# EAGLE design LDBiasDriver CC v2 (EAGLE 7.7.0)
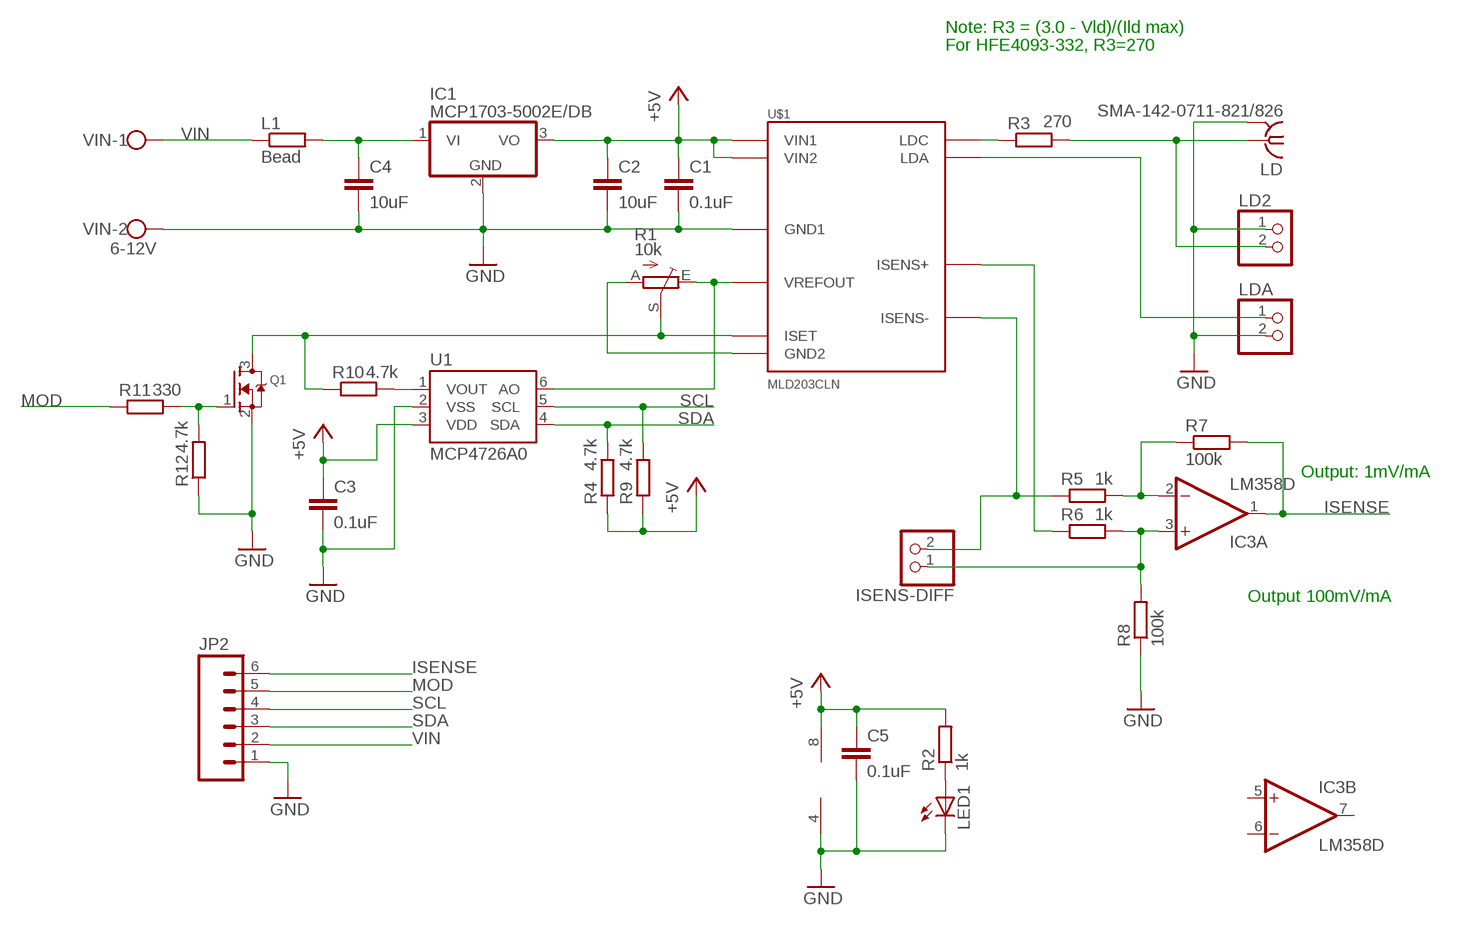
[diagram p0: schematic, sheet 1]

## Parts
C1  0.1uF  C-EUC0805  [C0805]
C2  10uF  C-EUC0805  [C0805]
C3  0.1uF  C-EUC0805  [C0805]
C4  10uF  C-EUC0805  [C0805]
C5  0.1uF  C-EUC0805  [C0805]
IC1  MCP1703-5002E/DB  MCP1703DB  [SOT223]
IC3  LM358D  [SO08]
ISENS-DIFF  PINHD-1X2  [1X02]
JP2  M06POLAR_LOCK  [MOLEX-1X6_LOCK]
L1  Bead  R-EU_R0805  [R0805]
LD  SMA-142-0711-821/826  [J502-ND-142-0711-821/826]
LD2  PINHD-1X2  [1X02]
LDA  PINHD-1X2  [1X02]
LED1  LEDCHIPLED_1206  [CHIPLED_1206]
Q1  MOSFET-NREFLOW  [SOT23]
R1  10k  TRIM_EU-RJ9W  [RJ9W]
R2  1k  R-EU_R0805  [R0805]
R3  270  R-EU_R0805  [R0805]
R4  4.7k  R-EU_R0805  [R0805]
R5  1k  R-EU_R0805  [R0805]
R6  1k  R-EU_R0805  [R0805]
R7  100k  R-EU_R0805  [R0805]
R8  100k  R-EU_R0805  [R0805]
R9  4.7k  R-EU_R0805  [R0805]
R10  4.7k  R-EU_R0805  [R0805]
R11  330  R-EU_R0805  [R0805]
R12  4.7k  R-EU_R0805  [R0805]
U1  MCP4726A0  MCP4725SOT-23  [SOT23-6]
U$1  MLD203CLN  [MLD203]
VIN  6-12V  W237-102  [W237-102]

## Nets
+5V: C1.1 C2.1 C3.1 C5.1 IC1.3(VO) IC3.8(P:V+) R2.2 R4.1 R9.1 U1.3(VDD) U$1.P$1(VIN1) U$1.P$2(VIN2)
GND: C1.2 C2.2 C3.2 C4.2 C5.2 IC1.2(GND) IC3.4(P:V-) JP2.1 LD2.1 LD.G@1 LD.G@2 LD.G@3 LD.G@4 LDA.2 LED1.C Q1.2(S) R8.1 R12.1 U1.2(VSS) U$1.P$3(GND1) VIN.2
ISENSE: IC3.1(A:OUT) JP2.6 R7.2
MOD: JP2.5 R11.1
N$2: R1.E U1.6(AO) U$1.P$5(VREFOUT)
N$3: LED1.A R2.1
N$4: Q1.3(D) R1.S R10.1 U$1.P$6(ISET)
N$5: R1.A U$1.P$4(GND2)
N$6: R6.1 U$1.P$12(ISENS+)
N$7: ISENS-DIFF.2 R5.1 U$1.P$13(ISENS-)
N$8: LD2.2 LD.1 R3.2
N$9: R3.1 U$1.P$11(LDC)
N$10: Q1.1(G) R11.2 R12.2
N$11: LDA.1 U$1.P$14(LDA)
N$13: R10.2 U1.1(VOUT)
N$15: C4.1 IC1.1(VI) L1.2
N$16: IC3.2(A:-IN) R5.2 R7.1
N$17: IC3.3(A:+IN) ISENS-DIFF.1 R6.2 R8.2
SCL: JP2.4 R9.2 U1.5(SCL)
SDA: JP2.3 R4.2 U1.4(SDA)
VIN: JP2.2 L1.1 VIN.1
Unconnected: IC3.5(B:+IN) IC3.6(B:-IN) IC3.7(B:OUT)

## Notes on the sheet
- Note: R3 = (3.0 - Vld)/(Ild max)
- For HFE4093-332, R3=270
- Output: 1mV/mA
- Output 100mV/mA

## Library data of the parts
C1-C5 = rcl:C-EU: CAPACITOR, European symbol
IC1 = linear:MCP1703: 250 mA, 16V, Low Quiescent Current LDO Regulator Source: http://ww1.microchip.com/downloads/en/DeviceDoc/22049b.pdf
IC3 = linear:LM358: OP AMP also LM158; LM258; LM2904 Source: http://cache.national.com/ds/LM/LM158.pdf
ISENS-DIFF LD2 LDA = pinhead:PINHD-1X2: PIN HEADER
JP2 = SparkFun-Connectors:M06: Header 6 Standard 6-pin 0.1" header. Use with straight break away headers (SKU : PRT-00116), right angle break away headers (PRT-00553), swiss pins (PRT-00743), machine pins (PRT-00117), and female headers (PRT-00115). Molex polarized connector foot print use with SKU : PRT-08094 with associated crimp pins and housings. NOTES ON THE VARIANTS LOCK and LOCK_LONGPADS... This footprint was designed to help hold the alignment of a through-hole component (i.e. 6-pin header) while soldering it into place. You may notice that each hole has been shifted either up or down by 0.005 of an inch from it's more standard position (which is a perfectly straight line). This slight alteration caused the pins (the squares in the middle) to touch the edges of the holes. Because they are alternating, it causes a "brace" to hold the component in place. 0.005 has proven to be the perfect amount of "off-center" position when using our standard breakaway headers. Although looks a little odd when you look at the bare footprint, once you have a header in there, the alteration is very hard to notice. Also,if you push a header all the way into place, it is covered up entirely on the bottom side. This idea of altering the position of holes to aid alignment will be further integrated into the Sparkfun Library for other footprints. It can help hold any component with 3 or more connection pins.
L1 R2-R12 = rcl:R-EU_: RESISTOR, European symbol
LD = con-coax:SMA-: SMA 50 Ohm End Launch Jack Receptacle - Round Contact Johnson Components Source: www.johnsoncomponents.com .. J502-ND.pdf; MF: JOHNSON COMPONENTS; MPN: 142-0711-821; OC_FARNELL: 1019328; OC_NEWARK: 16F3627
LED1 = led:LED: LED OSRAM: - CHIPLED LG R971, LG N971, LY N971, LG Q971, LY Q971, LO R971, LY R971 LH N974, LH R974 LS Q976, LO Q976, LY Q976 LO Q996 - Hyper CHIPLED LW Q18S LB Q993, LB Q99A, LB R99A - SideLED LS A670, LO A670, LY A670, LG A670, LP A670 LB A673, LV A673, LT A673, LW A673 LH A674 LY A675 LS A676, LA A676, LO A676, LY A676, LW A676 LS A679, LY A679, LG A679 - Hyper Micro SIDELED® LS Y876, LA Y876, LO Y876, LY Y876 LT Y87S - SmartLED LW L88C, LW L88S LB L89C, LB L89S, LG L890 LS L89K, LO L89K, LY L89K LS L896, LA L896, LO L896, LY L896 - TOPLED LS T670, LO T670, LY T670, LG T670, LP T670 LSG T670, LSP T670, LSY T670, LOP T670, LYG T670 LG T671, LOG T671, LSG T671 LB T673, LV T673, LT T673, LW T673 LH T674 LS T676, LA T676, LO T676, LY T676, LB T676, LH T676, LSB T676, LW T676 LB T67C, LV T67C, LT T67C, LS T67K, LO T67K, LY T67K, LW E67C LS E67B, LA E67B, LO E67B, LY E67B, LB E67C, LV E67C, LT E67C LW T67C LS T679, LY T679, LG T679 LS T770, LO T770, LY T770, LG T770, LP T770 LB T773, LV T773, LT T773, LW T773 LH T774 LS E675, LA E675, LY E675, LS T675 LS T776, LA T776, LO T776, LY T776, LB T776 LHGB T686 LT T68C, LB T68C - Hyper Mini TOPLED® LB M676 - Mini TOPLED Santana® LG M470 LS M47K, LO M47K, LY M47K Source: http://www.osram.convergy.de LUXEON: - LUMILED® LXK2-PW12-R00, LXK2-PW12-S00, LXK2-PW14-U00, LXK2-PW14-V00 LXK2-PM12-R00, LXK2-PM12-S00, LXK2-PM14-U00 LXK2-PE12-Q00, LXK2-PE12-R00, LXK2-PE12-S00, LXK2-PE14-T00, LXK2-PE14-U00 LXK2-PB12-K00, LXK2-PB12-L00, LXK2-PB12-M00, LXK2-PB14-N00, LXK2-PB14-P00, LXK2-PB14-Q00 LXK2-PR12-L00, LXK2-PR12-M00, LXK2-PR14-Q00, LXK2-PR14-R00 LXK2-PD12-Q00, LXK2-PD12-R00, LXK2-PD12-S00 LXK2-PH12-R00, LXK2-PH12-S00 LXK2-PL12-P00, LXK2-PL12-Q00, LXK2-PL12-R00 Source: www.luxeon.com KINGBRIGHT: KA-3528ASYC Source: www.kingbright.com
Q1 = adafruit:MOSFET-N: N-Channel Mosfet 2N7002E - 60V 260mA SOT23 [Digikey: 2N7002ET1GOSTR-ND] - REEL BSH103 - 30V 850mA SOT23 [Digikey: 568-5013-1-ND]
R1 = pot:TRIM_EU-: POTENTIOMETER
U1 = SparkFun-AnalogIC:MCP4725: Microchip 12-bit I2C DAC, SOT23-6; PROD_ID: IC-08886; VALUE: MCP4725
U$1 = laser diode:MLD203CLN
VIN = con-wago-500:W237-102: WAGO SCREW CLAMP; MPN: 237-102; OC_FARNELL: unknown; OC_NEWARK: 70K9898

## Board
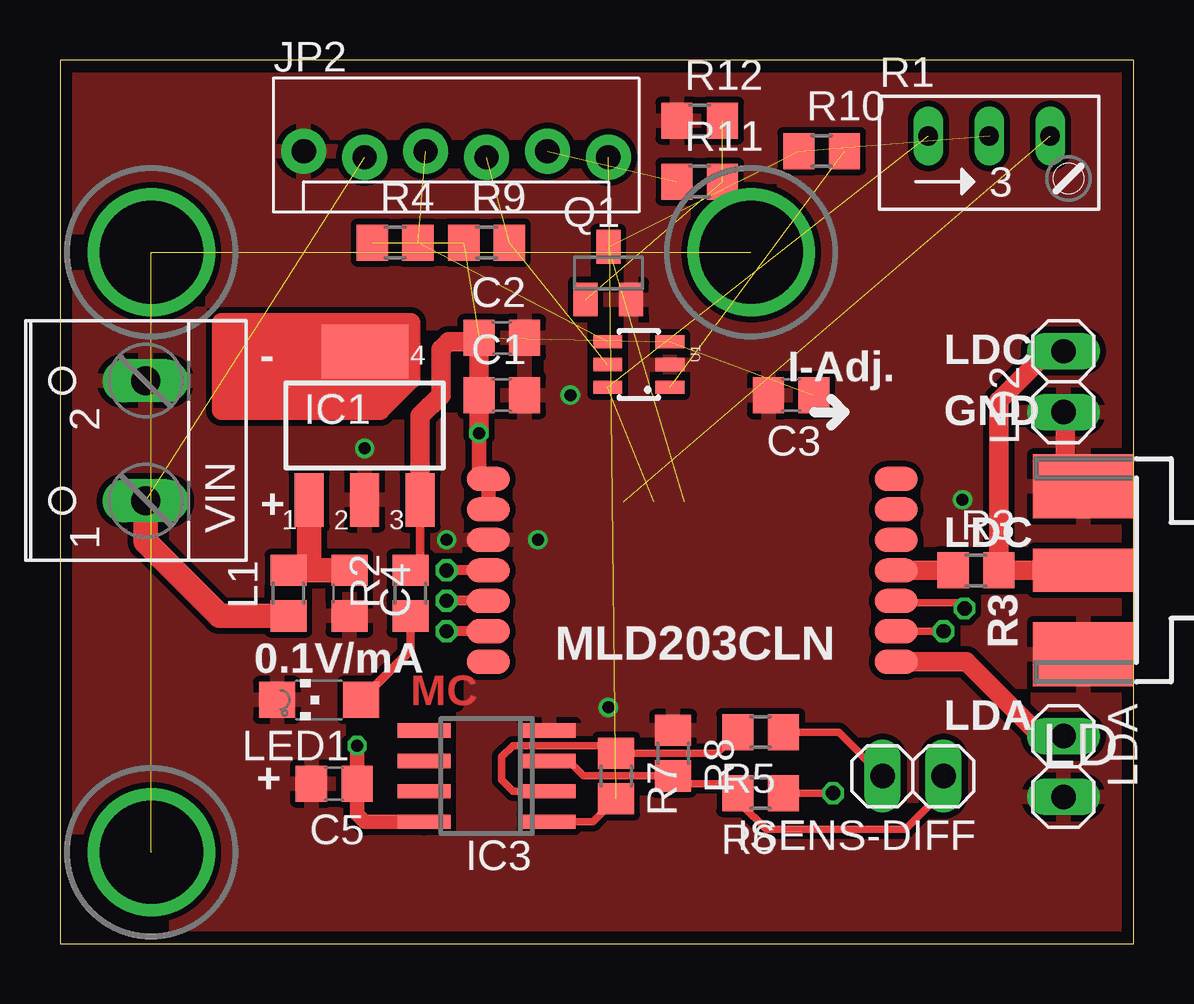
[diagram p1: board, top side]
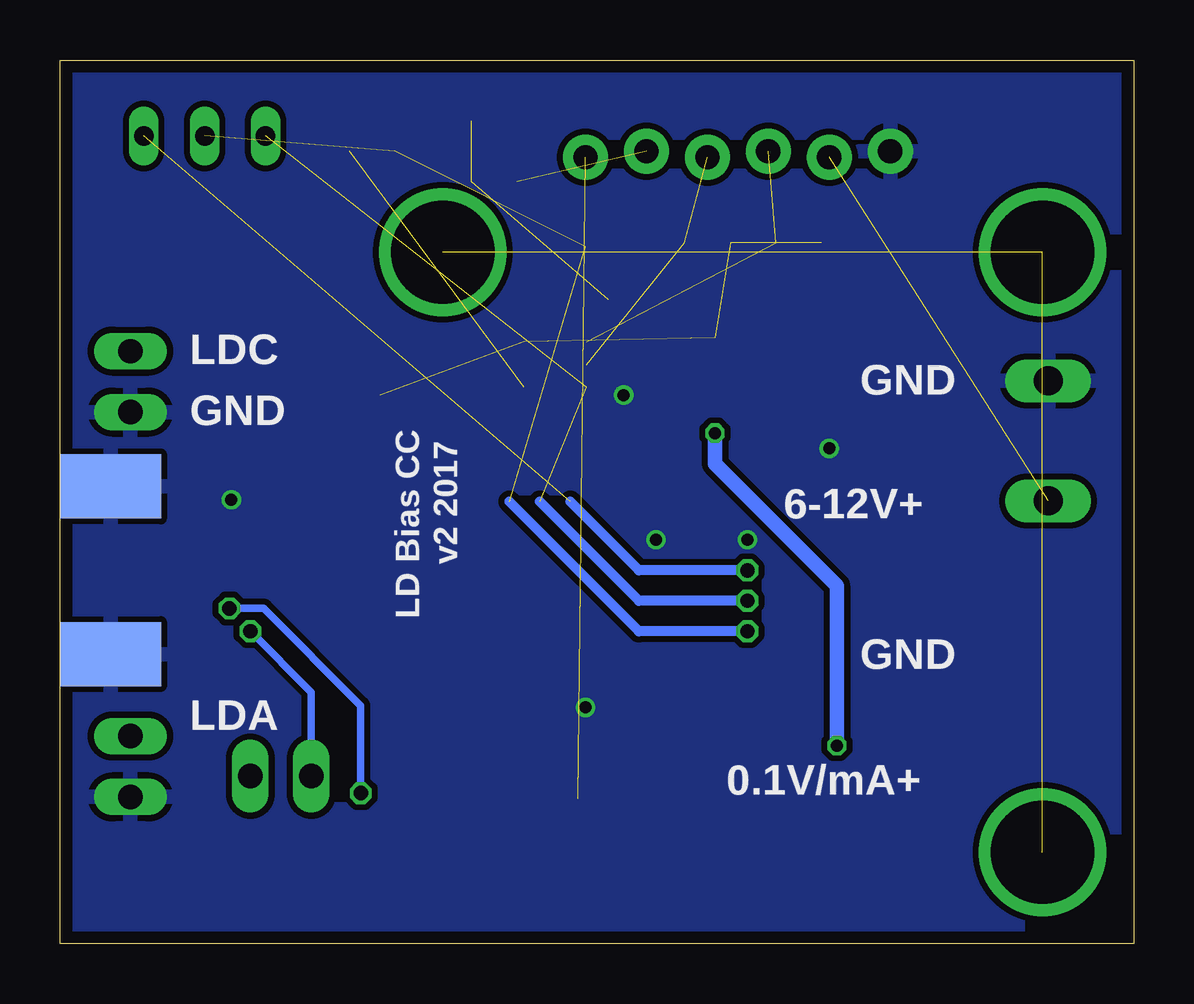
[diagram p2: board, bottom side, seen from below]

Size 44.77 x 36.82 mm. Coordinates in mm from the lower left corner, seen from the top.
Outline: 0,36.82 0,0 44.76,0 44.76,36.82 0,36.82
Copper layers (1*16): Top 0.035mm / dielectric 1.6mm / Bottom 0.035mm
Design rules "Elecrow_2-layer_PCB_eagle_rule *": minimum track width 6mil, minimum drill 12mil, track to track 10mil, track to pad 10mil, pad to pad 10mil, via to via 10mil, smd to smd 10mil, copper to edge 20mil, drill to drill 10mil, minimum pad ring 6mil, minimum via ring 6mil, stop-mask expansion 0mil, vias tented up to drill 100mil, thermal gap 10mil

### Footprints (pad centres in the part's own frame; a part is rotated, then mirrored left to right if it is on the bottom)
C0805 = smd 1.3 x 1.5: 1 -0.95,0; 2 0.95,0
SOT223 = smd 1.219 x 2.235: 1 -2.311,-3.099; 2 0,-3.099; 3 2.311,-3.099 | smd 3.6 x 2.2: 4 0,3.099
SO08 = smd 0.6 x 2.2: 1 -1.905,-2.6; 2 -0.635,-2.6; 3 0.635,-2.6; 4 1.905,-2.6; 5 1.905,2.6; 6 0.635,2.6; 7 -0.635,2.6; 8 -1.905,2.6
1X02 = drill 1.016 long: 1 -1.27,0; 2 1.27,0
MOLEX-1X6_LOCK = drill 1.016 pad 1.88: 1 0,0; 2 2.54,-0.254; 3 5.08,0; 4 7.62,-0.254; 5 10.16,0; 6 12.7,-0.254
R0805 = smd 1.3 x 1.5: 1 -0.95,0; 2 0.95,0
J502-ND-142-0711-821/826 = smd 4.191 x 1.778: 1 2.115,0 | smd 4.191 x 2.667: G@1 2.115,3.495; G@2 2.115,-3.495 | smd 4.191 x 2.667 bottom: G@3 2.115,3.495; G@4 2.115,-3.495
CHIPLED_1206 = smd 1.5 x 1.5: A 0,-1.75; C 0,1.75
SOT23 = smd 1 x 1.4: 1 -0.95,-1.1; 2 0.95,-1.1; 3 0,1.1
RJ9W = drill 0.813 long: A 2.54,0.635; E -2.54,0.635; S 0,0.635
SOT23-6 = smd 0.55 x 1.2: 1 0.95,1.3; 2 0,1.3; 3 -0.95,1.3; 4 -0.95,-1.3; 5 0,-1.3; 6 0.95,-1.3
MLD203 = smd 1.8 x 1: P$1 0,0; P$2 0,-1.27; P$3 0,-2.54; P$4 0,-3.81; P$5 0,-5.08; P$6 0,-6.35; P$7 0,-7.62; P$8 17,0; P$9 17,-1.27; P$10 17,-2.54; P$11 17,-3.81; P$12 17,-5.08; P$13 17,-6.35; P$14 17,-7.62
W237-102 = drill 1.194 long: 1 -2.5,-1.27; 2 2.5,-1.27

### Placement (x,y rotation side)
C1  18.41,22.86 0 top
C2  18.41,25.24 0 top
C3  30.48,22.86 180 top
C4  12.06,14.61 270 top
C5  11.43,6.67 180 top
IC1  12.7,21.59 0 top
IC3  17.78,6.99 90 top
ISENS-DIFF  35.56,6.99 180 top
JP2  10.16,33.02 0 top
L1  9.53,14.61 90 top
LD  44.77,15.56 180 top
LD2  41.83,23.42 90 top
LDA  41.83,7.38 270 top
LED1  10.79,10.16 90 top
Q1  22.86,27.94 0 top
R1  38.73,33.02 0 top
R2  14.61,14.61 90 top
R3  38.18,15.56 0 top
R4  13.97,29.21 0 top
R5  29.21,8.81 180 top
R6  29.21,6.27 180 top
R7  23.18,6.99 270 top
R8  25.56,7.94 270 top
R9  17.78,29.21 0 top
R10  31.75,33.02 0 top
R11  26.67,31.75 0 top
R12  26.67,34.29 0 top
U1  24.13,24.13 270 top
U$1  17.86,19.37 0 top
VIN  2.3,20.95 90 top

### Tracks (layer width: path | path; a pad name or v marks a point on that pad's centre or on a via)
+5V  (via drill 0.5)  (4 unrouted)
  Top 0.356: IC1.3 15.01,15.96
  Top 0.61: 15.01,15.96 R2.2 | IC3.8 12.7,5.08 12.38,5.4 C5.1 12.7,6.99 12.38,7.3 v12.38,8.26 | U$1.P$2 U$1.P$1 17.46,19.76 v17.46,21.27
  Top 0.813: IC1.3 15.01,22 15.88,22.86 15.88,24.77 16.19,25.08 17.31,25.08 C2.1 C1.1 v17.46,21.27
  Bottom 0.61: v17.46,21.27 17.46,20 12.38,14.92 v12.38,8.26
GND  (via drill 0.5)
  Top 0.813: LD2.1 41.91,22.15 41.91,19.05 LD.G@2
  other vias: 21.27,22.86 22.86,9.84 12.7,20.64 16.11,16.83 19.92,16.83 37.62,18.49
  pour Top: 0,36.83 44.69,36.83 47.23,-1.27 -1.27,-1.27
  pour Bottom: 0,36.83 44.85,36.83 48.66,-1.35 -2.54,-2.62
ISENSE  (1 unrouted)
  Top 0.305: R7.2 22.22,5.08 IC3.1
MOD  (1 unrouted)
N$1
  Top 0.813: 13.97,25.4 6.75,25.4 | 6.75,25.4 6.75,22.23 13.34,22.23 14.61,23.5 14.61,25.88 6.75,25.88 6.75,25.4
N$2  (via drill 0.6)  (2 unrouted)
  Top 0.406: U$1.P$5 v16.11,14.29
  Bottom 0.406: v16.11,14.29 20.64,14.29 24.77,18.41
N$3
  Top 0.356: R2.1 14.61,12.22 LED1.A
N$4  (via drill 0.6)  (3 unrouted)
  Top 0.406: U$1.P$6 v16.11,13.02
  Bottom 0.406: v16.11,13.02 20.64,13.02 26.04,18.41
N$5  (via drill 0.6)  (1 unrouted)
  Top 0.406: U$1.P$4 v16.11,15.56
  Bottom 0.406: v16.11,15.56 20.64,15.56 23.5,18.41
N$6  (via drill 0.6)
  Top 0.305: U$1.P$12 34.94,14.21 37.47,14.21 v37.7,13.97 | v32.23,6.27 R6.1
  Bottom 0.305: v37.7,13.97 36.27,13.97 32.23,9.92 v32.23,6.27
N$7  (via drill 0.6)
  Top 0.305: R5.1 32.46,8.81 ISENS-DIFF.2 | U$1.P$13 v36.83,13.02
  Bottom 0.305: v36.83,13.02 34.29,10.48 ISENS-DIFF.2
N$8
  Top 0.813: LD.1 R3.2 39.13,22.62 41.2,24.69 LD2.2
N$9
  Top 0.813: U$1.P$11 R3.1
N$10  (2 unrouted)
N$11
  Top 0.813: U$1.P$14 37.78,11.75 40.64,8.89 41.59,8.89 LDA.1
N$13  (1 unrouted)
N$15
  Top 1.016: L1.2 10.16,15.55 | 10.16,15.55 C4.1 | IC1.1 10.39,15.78 10.16,15.55
N$16
  Top 0.305: R5.2 27.38,7.93 R7.1 22.86,7.93 22.54,8.26 18.89,8.26 18.41,7.78 18.41,6.83 18.89,6.35 IC3.2
N$17
  Top 0.305: 28.42,5.79 29.45,4.76 35.24,4.76 36.83,6.35 | R6.2 27.78,6.67 25.8,6.67 R8.2 21.83,6.99 21.19,7.62 IC3.3
  Top 0.356: R6.2 28.26,6.67 28.42,5.79 | 36.83,6.35 ISENS-DIFF.1
  Top 0.61: R8.2 25.72,6.67
N$18  (via drill 4.3)  (2 unrouted)
  other vias: 3.81,3.81 3.81,28.81 28.81,28.81
N$19
  Top 0.813: 7.38,24.77 12.06,24.77 11.43,24.13 7.38,24.21 7.38,22.86 13.34,22.86 13.97,23.5 | 13.97,23.5 14.29,23.5 | 13.97,23.5 7.94,23.5
SCL  (2 unrouted)
SDA  (2 unrouted)
VIN  (1 unrouted)
  Top 1.016: VIN.1 3.57,16.75 6.67,13.65 L1.1

### Text on the board
Top: MC
tStop: MC
bStop: Mitchell A. Cox
tSilk: - | LDC | I-Adj. | GND | + | LDC | R3 | MLD203CLN | 0.1V/mA | LDA | +
bSilk: LDC | GND | GND | v2 2017 | LD Bias CC | 6-12V+ | GND | LDA | 0.1V/mA+